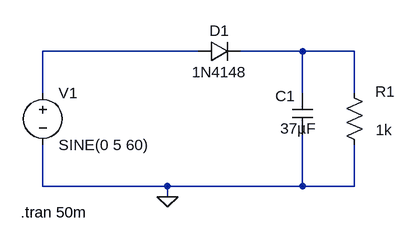
[diagram p0: schematic Half_Wave_1N4148_cap.asc]
Half_Wave_1N4148_cap.asc, the LTspice schematic file:
Version 4
SHEET 1 880 680
WIRE 176 96 -64 96
WIRE 336 96 240 96
WIRE 416 96 336 96
WIRE -64 160 -64 96
WIRE 336 160 336 96
WIRE 416 160 416 96
WIRE -64 304 -64 240
WIRE 128 304 -64 304
WIRE 336 304 336 224
WIRE 336 304 128 304
WIRE 416 304 416 240
WIRE 416 304 336 304
WIRE 128 320 128 304
FLAG 128 320 0
SYMBOL diode 176 112 R270
WINDOW 0 32 32 VTop 2
WINDOW 3 0 32 VBottom 2
SYMATTR InstName D1
SYMATTR Value 1N4148
SYMBOL voltage -64 144 R0
WINDOW 123 0 0 Left 0
WINDOW 39 0 0 Left 0
SYMATTR InstName V1
SYMATTR Value SINE(0 5 60)
SYMBOL res 432 256 R180
WINDOW 0 -47 98 Left 2
WINDOW 3 -42 39 Left 2
SYMATTR InstName R1
SYMATTR Value 1k
SYMBOL cap 320 160 R0
WINDOW 0 -26 5 Left 2
WINDOW 3 -18 55 Left 2
SYMATTR InstName C1
SYMATTR Value 37µF
TEXT -98 344 Left 2 !.tran 50m

The netlist it stands for:
* Half_Wave_1N4148_cap.asc
D1 N001 N002 1N4148
V1 N001 0 SINE(0 5 60)
R1 0 N002 1k
C1 N002 0 37µF
.model D D
.lib standard.dio
.tran 50m
.backanno
.end